# EAGLE design TRNG (EAGLE 9.5.2)
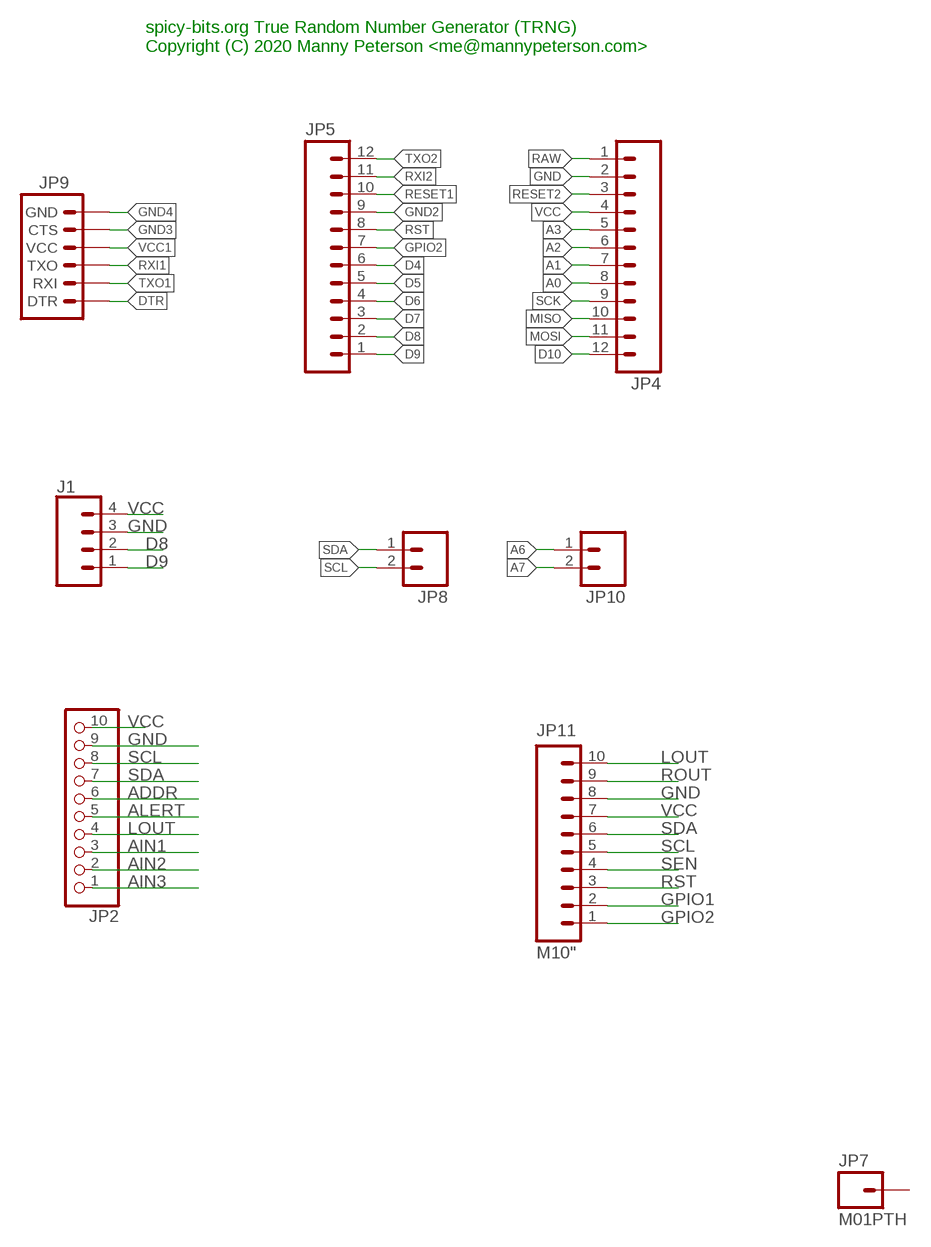
[diagram p0: schematic, sheet 1]

## Parts
J1  CONN_04PTH  [1X04]
JP2  HEADER-1X1070MIL  [1X10_ROUND70]
JP4  M12PTH  [1X12]
JP5  M12PTH  [1X12]
JP7  M01PTH  [1X01]
JP8  M02PTH  [1X02]
JP9  ARDUINO_SERIAL_PROGRAMPTH  [1X06]
JP10  M02PTH  [1X02]
JP11  M10"  [1X10]

## Nets
A0: JP4.8
A1: JP4.7
A2: JP4.6
A3: JP4.5
A6: JP10.1
A7: JP10.2
ADDR: JP2.6
AIN1: JP2.3
AIN2: JP2.2
AIN3: JP2.1
ALERT: JP2.5
D4: JP5.6
D5: JP5.5
D6: JP5.4
D7: JP5.3
D8: J1.2 JP5.2
D9: J1.1 JP5.1
D10: JP4.12
DTR: JP9.1(DTR)
GND: J1.3 JP2.9 JP4.2 JP11.8
GND2: JP5.9
GND3: JP9.5(CTS)
GND4: JP9.6(GND)
GPIO1: JP11.2
GPIO2: JP5.7 JP11.1
LOUT: JP2.4 JP11.10
MISO: JP4.10
MOSI: JP4.11
RAW: JP4.1
RESET1: JP5.10
RESET2: JP4.3
ROUT: JP11.9
RST: JP5.8 JP11.3
RXI1: JP9.3(TXO)
RXI2: JP5.11
SCK: JP4.9
SCL: JP2.8 JP8.2 JP11.5
SDA: JP2.7 JP8.1 JP11.6
SEN: JP11.4
TXO1: JP9.2(RXI)
TXO2: JP5.12
VCC: J1.4 JP2.10 JP4.4 JP11.7
VCC1: JP9.4(VCC)
Unconnected: JP7.1

## Notes on the sheet
- spicy-bits.org True Random Number Generator (TRNG)
  Copyright (C) 2020 Manny Peterson <me@mannypeterson.com>

## Library data of the parts
J1 = SparkFun-Connectors:CONN_04: Multi connection point. Often used as Generic Header-pin footprint for 0.1 inch spaced/style header connections On any of the 0.1 inch spaced packages, you can populate with these: Break Away Headers - Straight <https://www.sparkfun.com/products/116> (PRT-00116) Break Away Male Headers - Right Angle <https://www.sparkfun.com/products/553> (PRT-00553) Female Headers <https://www.sparkfun.com/products/115> (PRT-00115) Break Away Headers - Machine Pin <https://www.sparkfun.com/products/117> (PRT-00117) Break Away Female Headers - Swiss Machine Pin <https://www.sparkfun.com/products/743> (PRT-00743) For SCREWTERMINALS and SPRING TERMINALS visit here: Screw Terimnals on SparkFun.com <https://www.sparkfun.com/search/results?term=Screw+Terminals> (5mm/3.5mm/2.54mm spacing) This device is also useful as a general connection point to wire up your design to another part of your project. Our various solder wires solder well into these plated through hole pads. Hook-Up Wire - Assortment (Stranded, 22 AWG) <https://www.sparkfun.com/products/11375> (PRT-11375) Hook-Up Wire - Assortment (Solid Core, 22 AWG) <https://www.sparkfun.com/products/11367> (PRT-11367) View the entire wire category on our website here <https://www.sparkfun.com/categories/141> Special notes: Molex polarized connector foot print use with SKU : PRT-08231 with associated crimp pins and housings. 1MM SMD Version SKU: PRT-10208; PROD_ID: CONN-09696
JP2 = microbuilder:HEADER-1X10: PIN HEADER
JP4 JP5 = SparkFun:M12: Header 12 Standard 12-pin 0.1" header. Use with straight break away headers (SKU : PRT-00116), right angle break away headers (PRT-00553), swiss pins (PRT-00743), machine pins (PRT-00117), and female headers (PRT-00115).
JP7 = SparkFun-Connectors:M01: Header 1 Standard 1-pin 0.1" header. Use with straight break away headers (SKU : PRT-00116), right angle break away headers (PRT-00553), swiss pins (PRT-00743), machine pins (PRT-00117), and female headers (PRT-00115).
JP8 JP10 = SparkFun:M02: Header 2 Standard 2-pin 0.1" header. Use with straight break away headers (SKU : PRT-00116), right angle break away headers (PRT-00553), swiss pins (PRT-00743), machine pins (PRT-00117), and female headers (PRT-00115). Molex polarized connector foot print use with SKU : PRT-08233 with associated crimp pins and housings.
JP9 = SparkFun:ARDUINO_SERIAL_PROGRAM
JP11 = SparkFun-Connectors:M10: Header 10 Standard 10-pin 0.1" header. Use with straight break away headers (SKU : PRT-00116), right angle break away headers (PRT-00553), swiss pins (PRT-00743), machine pins (PRT-00117), and female headers (PRT-00115).

## Board
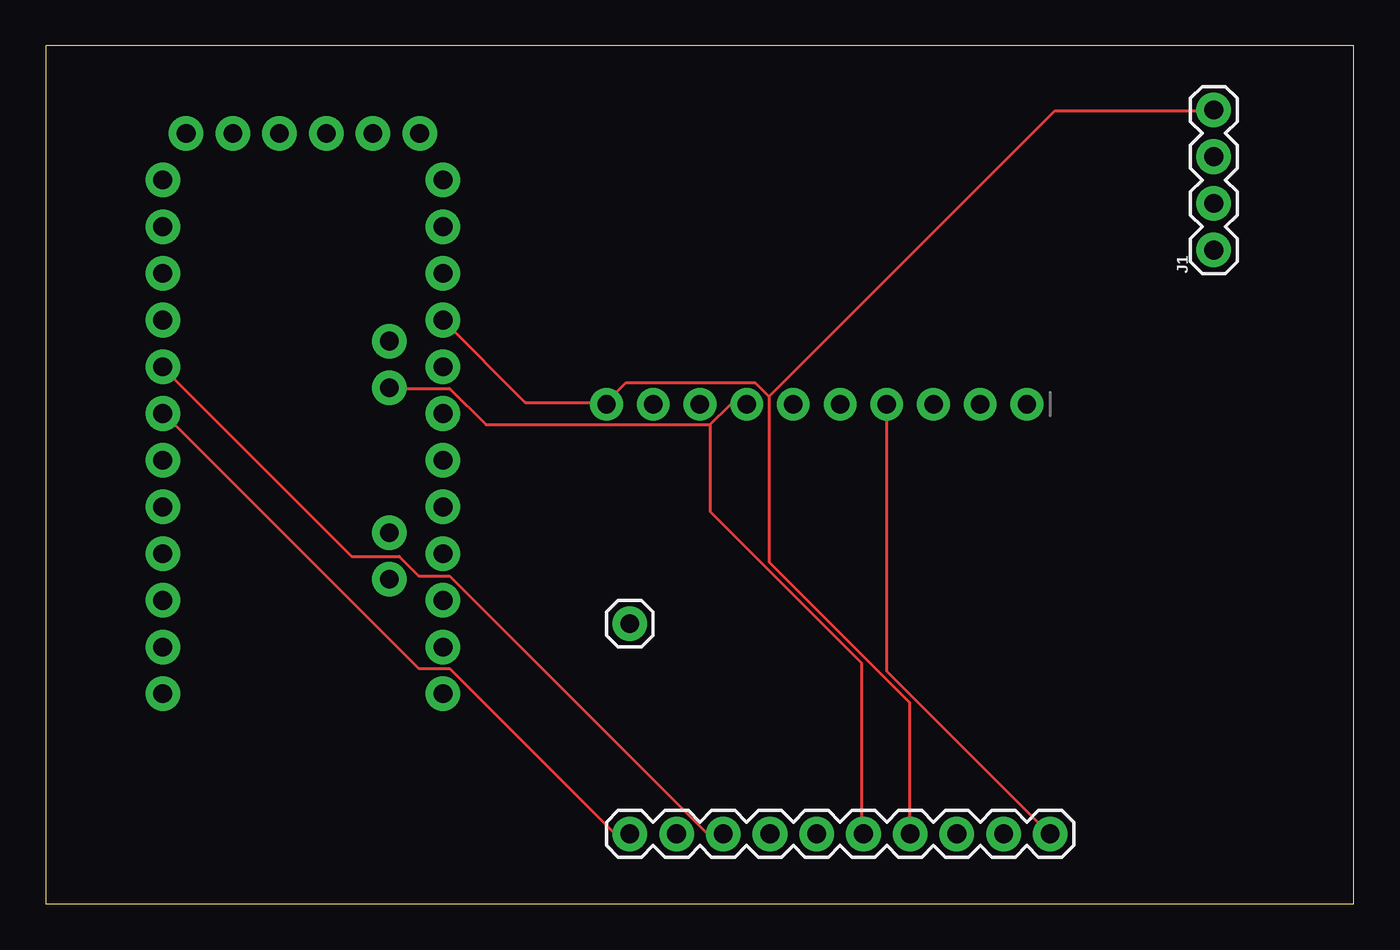
[diagram p1: board, top side]
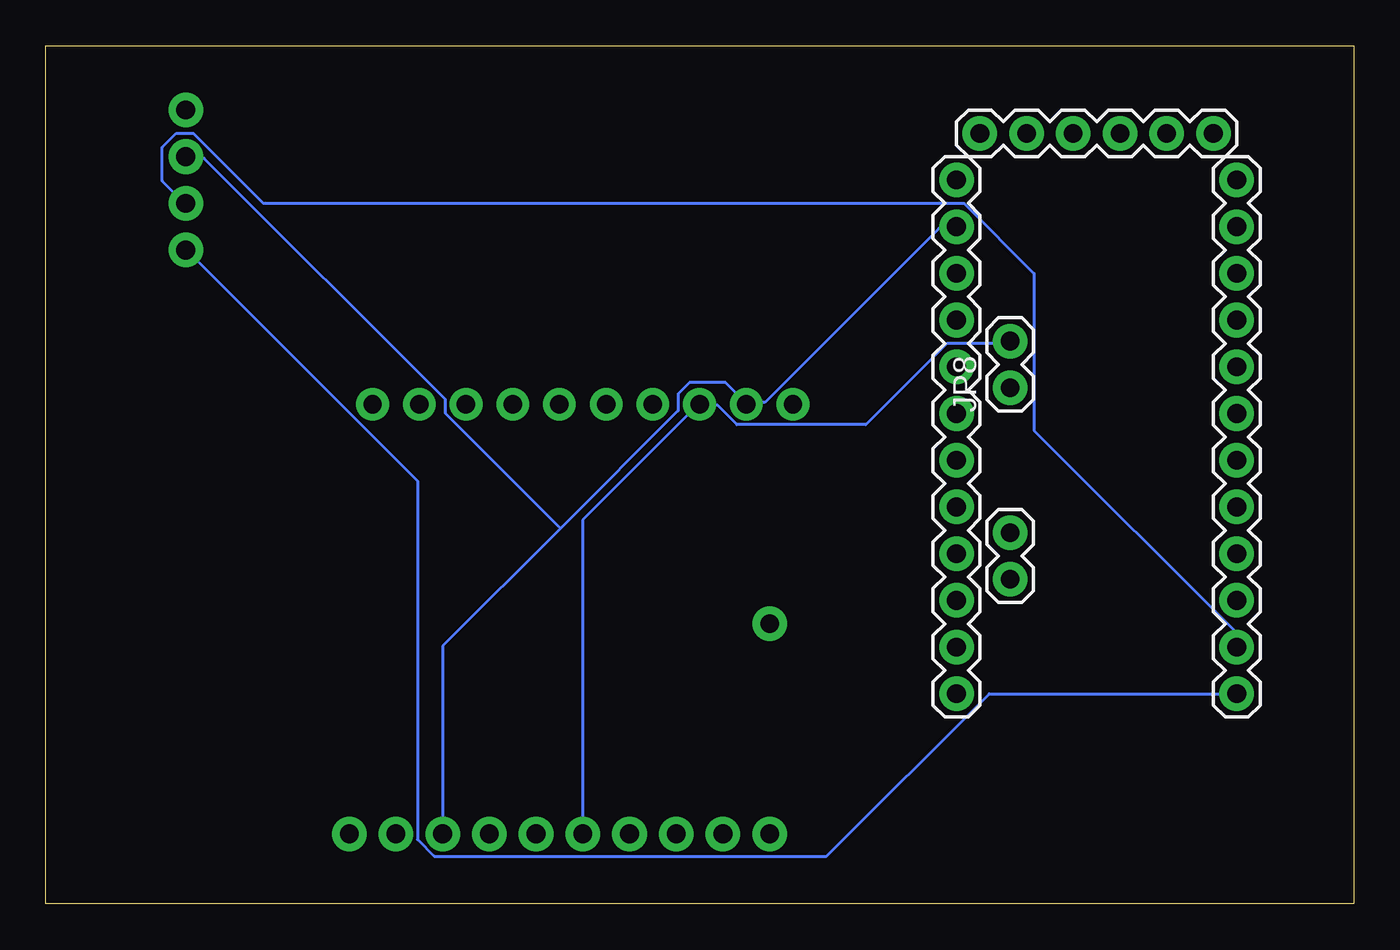
[diagram p2: board, bottom side, seen from below]

Size 71.1 x 46.66 mm. Coordinates in mm from the lower left corner, seen from the top.
Outline: 0,0 71.1,0 71.1,46.66 0,46.66 0,0
Copper layers (1*16): Top 0.035mm / dielectric 1.5mm / Bottom 0.035mm
Design rules "default": minimum track width 6mil, minimum drill 0.35mm, track to track 6mil, track to pad 6mil, pad to pad 6mil, via to via 6mil, smd to smd 6mil, copper to edge 40mil, drill to drill 6mil, minimum pad ring 10mil, minimum via ring 8mil, stop-mask expansion 4mil, vias tented up to drill 0mil, thermal gap 10mil

### Footprints (pad centres in the part's own frame; a part is rotated, then mirrored left to right if it is on the bottom)
1X04 = drill 1.016 pad 1.88: 1 0,0; 2 2.54,0; 3 5.08,0; 4 7.62,0
1X10_ROUND70 = drill 1 pad 1.778: 1 -11.43,0; 2 -8.89,0; 3 -6.35,0; 4 -3.81,0; 5 -1.27,0; 6 1.27,0; 7 3.81,0; 8 6.35,0; 9 8.89,0; 10 11.43,0
1X12 = drill 1.016 pad 1.88: 1 0,0; 2 2.54,0; 3 5.08,0; 4 7.62,0; 5 10.16,0; 6 12.7,0; 7 15.24,0; 8 17.78,0; 9 20.32,0; 10 22.86,0; 11 25.4,0; 12 27.94,0
1X01 = drill 1.016 pad 1.88: 1 0,0
1X02 = drill 1.016 pad 1.88: 1 0,0; 2 2.54,0
1X06 = drill 1.016 pad 1.88: 1 0,0; 2 2.54,0; 3 5.08,0; 4 7.62,0; 5 10.16,0; 6 12.7,0
1X10 = drill 1.016 pad 1.88: 1 0,0; 2 2.54,0; 3 5.08,0; 4 7.62,0; 5 10.16,0; 6 12.7,0; 7 15.24,0; 8 17.78,0; 9 20.32,0; 10 22.86,0

### Placement (x,y rotation side)
J1  63.5,35.56 90 top
JP2  41.91,27.18 180 top
JP4  21.59,39.37 270 bottom
JP5  6.35,11.43 90 bottom
JP7  31.75,15.24 0 top
JP8  18.67,28.07 90 bottom
JP9  20.32,41.91 0 bottom
JP10  18.67,17.65 90 bottom
JP11  31.75,3.81 0 top

### Tracks (layer width: path | path; a pad name or v marks a point on that pad's centre or on a via)
D8
  Bottom 0.152: JP5.2 6.4,14.02 6.4,14.78 17.37,25.76 17.37,34.29 21.18,38.1 59.28,38.1 63.09,41.91 64.01,41.91 64.77,41.15 64.77,39.32 63.55,38.1 J1.2
D9
  Bottom 0.152: JP5.1 19.81,11.43 28.65,2.59 49.99,2.59 50.9,3.5 50.9,23.01 63.4,35.51 J1.1
GND
  Bottom 0.152: JP4.2 21.64,36.73 22.55,36.73 32,27.28 32.92,27.28 JP2.9 33.07,27.28 34.14,28.35 36.12,28.35 36.73,27.74 36.73,26.82 43.13,20.42 | JP11.8 49.53,14.02 43.13,20.42 | 43.13,20.42 49.38,26.67 49.38,27.43 62.48,40.54 63.4,40.54 J1.3
GPIO2
  Top 0.152: JP11.1 30.94,3.81 21.95,12.8 20.27,12.8 6.4,26.67 JP5.7
LOUT
  Top 0.152: JP2.4 45.72,12.65 54.56,3.81 JP11.10
RST
  Top 0.152: JP11.3 35.97,3.81 21.95,17.83 20.27,17.83 19.2,18.9 16.61,18.9 6.4,29.11 JP5.8
SCL
  Bottom 0.152: JP8.2 18.75,30.48 22.1,30.48 26.52,26.06 33.53,26.06 34.59,27.13 35.51,27.13 JP2.8 35.66,27.13 41.91,20.88 JP11.5
SDA
  Top 0.152: 36.12,26.06 37.19,27.13 38.1,27.13 JP2.7 | 36.12,26.06 23.93,26.06 21.95,28.04 18.75,28.04 JP8.1 | 36.12,26.06 36.12,21.34 44.35,13.11 44.35,3.81 JP11.6
VCC
  Top 0.152: 30.48,27.28 26.06,27.28 JP4.4 | 39.32,27.58 39.32,18.59 46.94,10.97 46.94,3.81 JP11.7 | 39.32,27.58 38.56,28.35 31.55,28.35 30.48,27.28 | 30.48,27.28 JP2.10 | 39.32,27.58 54.86,43.13 63.4,43.13 J1.4